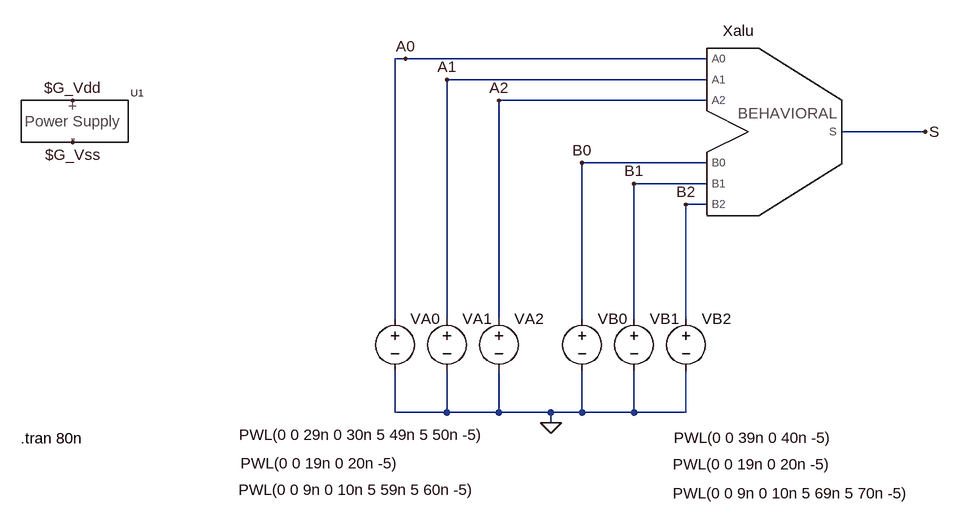
[diagram p0: schematic alu-fast_test.asc]
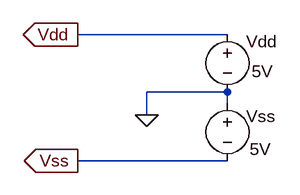
[diagram p1: sub-circuit tpower.asc]
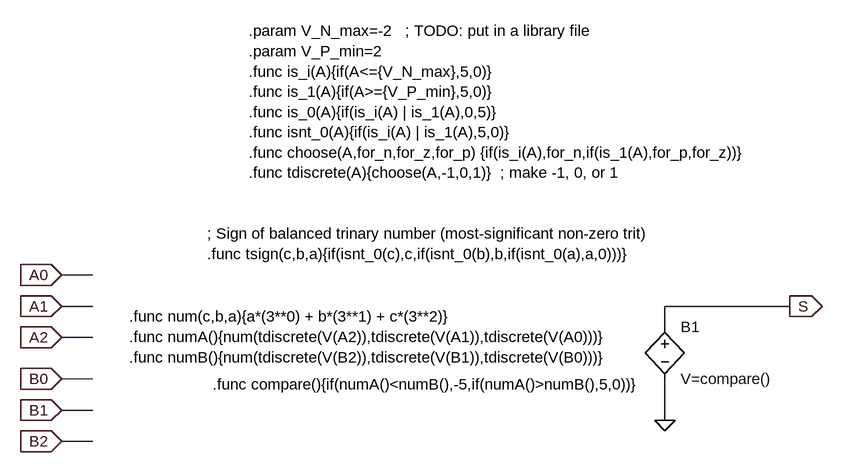
[diagram p2: sub-circuit alu-fast.asc]
alu-fast_test.asc, the LTspice schematic file:
Version 4
SHEET 1 988 700
WIRE -112 16 -128 16
WIRE 352 16 -112 16
WIRE 352 48 -48 48
WIRE 352 80 32 80
WIRE 688 128 560 128
WIRE 352 176 160 176
WIRE 352 208 240 208
WIRE 352 240 320 240
WIRE -128 416 -128 16
WIRE -48 416 -48 48
WIRE 32 416 32 80
WIRE 160 416 160 176
WIRE 240 416 240 208
WIRE 320 416 320 240
WIRE -128 560 -128 496
WIRE -48 560 -48 496
WIRE -48 560 -128 560
WIRE 32 560 32 496
WIRE 32 560 -48 560
WIRE 112 560 32 560
WIRE 160 560 160 496
WIRE 160 560 112 560
WIRE 240 560 240 496
WIRE 240 560 160 560
WIRE 320 560 320 496
WIRE 320 560 240 560
WIRE 112 576 112 560
FLAG -624 80 $G_Vdd
FLAG -624 144 $G_Vss
FLAG 688 128 S
FLAG 112 576 0
FLAG -112 16 A0
FLAG -48 48 A1
FLAG 32 80 A2
FLAG 160 176 B0
FLAG 240 208 B1
FLAG 320 240 B2
SYMBOL tpower -624 112 R0
SYMATTR InstName U1
SYMBOL alu-fast 400 16 R0
SYMATTR InstName Xalu
SYMBOL voltage 320 400 R0
WINDOW 3 -20 284 Left 0
WINDOW 123 0 0 Left 0
WINDOW 39 0 0 Left 0
SYMATTR Value PWL(0 0 9n 0 10n 5 69n 5 70n -5)
SYMATTR InstName VB2
SYMBOL voltage 240 400 R0
WINDOW 3 60 240 Left 0
WINDOW 123 0 0 Left 0
WINDOW 39 0 0 Left 0
SYMATTR Value PWL(0 0 19n 0 20n -5)
SYMATTR InstName VB1
SYMBOL voltage 160 400 R0
WINDOW 3 141 199 Left 0
WINDOW 123 0 0 Left 0
WINDOW 39 0 0 Left 0
SYMATTR Value PWL(0 0 39n 0 40n -5)
SYMATTR InstName VB0
SYMBOL voltage 32 400 R0
WINDOW 3 -401 279 Left 0
WINDOW 123 0 0 Left 0
WINDOW 39 0 0 Left 0
SYMATTR Value PWL(0 0 9n 0 10n 5 59n 5 60n -5)
SYMATTR InstName VA2
SYMBOL voltage -48 400 R0
WINDOW 3 -318 238 Left 0
WINDOW 123 0 0 Left 0
WINDOW 39 0 0 Left 0
SYMATTR Value PWL(0 0 19n 0 20n -5)
SYMATTR InstName VA1
SYMBOL voltage -128 400 R0
WINDOW 3 -240 194 Left 0
WINDOW 123 0 0 Left 0
WINDOW 39 0 0 Left 0
SYMATTR Value PWL(0 0 29n 0 30n 5 49n 5 50n -5)
SYMATTR InstName VA0
TEXT -704 600 Left 0 !.tran 80n

tpower.asc, the sub-circuit schematic file:
Version 4
SHEET 1 880 680
WIRE -112 32 -320 32
WIRE -112 112 -224 112
WIRE -112 128 -112 112
WIRE -224 144 -224 112
WIRE -112 208 -320 208
FLAG -224 144 0
FLAG -320 32 Vdd
IOPIN -320 32 Out
FLAG -320 208 Vss
IOPIN -320 208 Out
SYMBOL voltage -112 16 R0
WINDOW 0 26 26 Left 0
WINDOW 3 34 68 Left 0
SYMATTR InstName Vdd
SYMATTR Value 5V
SYMBOL voltage -112 112 R0
WINDOW 0 26 34 Left 0
WINDOW 3 31 80 Left 0
SYMATTR InstName Vss
SYMATTR Value 5V

alu-fast.asc, the sub-circuit schematic file:
Version 4
SHEET 1 992 680
WIRE -416 144 -464 144
WIRE -416 192 -464 192
WIRE 656 192 464 192
WIRE 464 224 464 192
WIRE -416 240 -464 240
WIRE -416 304 -464 304
WIRE -416 352 -464 352
WIRE 464 368 464 304
WIRE -416 400 -464 400
FLAG -464 144 A0
IOPIN -464 144 In
FLAG -464 192 A1
IOPIN -464 192 In
FLAG -464 240 A2
IOPIN -464 240 In
FLAG -464 304 B0
IOPIN -464 304 In
FLAG -464 352 B1
IOPIN -464 352 In
FLAG -464 400 B2
IOPIN -464 400 In
FLAG 656 192 S
IOPIN 656 192 Out
FLAG 464 368 0
SYMBOL bv 464 208 R0
SYMATTR InstName B1
SYMATTR Value V=compare()
TEXT -176 -232 Left 0 !.param V_N_max=-2   ; TODO: put in a library file\n.param V_P_min=2\n.func is_i(A){if(A<={V_N_max},5,0)}\n.func is_1(A){if(A>={V_P_min},5,0)}\n.func is_0(A){if(is_i(A) | is_1(A),0,5)}\n.func isnt_0(A){if(is_i(A) | is_1(A),5,0)}\n.func choose(A,for_n,for_z,for_p) {if(is_i(A),for_n,if(is_1(A),for_p,for_z))}\n.func tdiscrete(A){choose(A,-1,0,1)}  ; make -1, 0, or 1
TEXT -232 312 Left 0 !.func compare(){if(numA()<numB(),-5,if(numA()>numB(),5,0))}
TEXT -240 80 Left 0 !; Sign of balanced trinary number (most-significant non-zero trit)\n.func tsign(c,b,a){if(isnt_0(c),c,if(isnt_0(b),b,if(isnt_0(a),a,0)))}
TEXT -360 208 Left 0 !.func num(c,b,a){a*(3**0) + b*(3**1) + c*(3**2)}\n.func numA(){num(tdiscrete(V(A2)),tdiscrete(V(A1)),tdiscrete(V(A0)))}\n.func numB(){num(tdiscrete(V(B2)),tdiscrete(V(B1)),tdiscrete(V(B0)))}

The netlist it stands for:
* alu-fast_test.asc
XU1 $G_Vdd $G_Vss tpower
XXalu A0 A1 A2 B0 B1 B2 S alu-fast
VB2 B2 0 PWL(0 0 9n 0 10n 5 69n 5 70n -5)
VB1 B1 0 PWL(0 0 19n 0 20n -5)
VB0 B0 0 PWL(0 0 39n 0 40n -5)
VA2 A2 0 PWL(0 0 9n 0 10n 5 59n 5 60n -5)
VA1 A1 0 PWL(0 0 19n 0 20n -5)
VA0 A0 0 PWL(0 0 29n 0 30n 5 49n 5 50n -5)

* block symbol definitions
.subckt tpower Vdd Vss
Vdd Vdd 0 5V
Vss 0 Vss 5V
.ends tpower

.subckt alu-fast A0 A1 A2 B0 B1 B2 S
B1 S 0 V=compare()
.param V_N_max=-2   ; TODO: put in a library file
.param V_P_min=2
.func is_i(A){if(A<={V_N_max},5,0)}
.func is_1(A){if(A>={V_P_min},5,0)}
.func is_0(A){if(is_i(A) | is_1(A),0,5)}
.func isnt_0(A){if(is_i(A) | is_1(A),5,0)}
.func choose(A,for_n,for_z,for_p) {if(is_i(A),for_n,if(is_1(A),for_p,for_z))}
.func tdiscrete(A){choose(A,-1,0,1)}  ; make -1, 0, or 1
.func compare(){if(numA()<numB(),-5,if(numA()>numB(),5,0))}
; Sign of balanced trinary number (most-significant non-zero trit)
.func tsign(c,b,a){if(isnt_0(c),c,if(isnt_0(b),b,if(isnt_0(a),a,0)))}
.func num(c,b,a){a*(3**0) + b*(3**1) + c*(3**2)}
.func numA(){num(tdiscrete(V(A2)),tdiscrete(V(A1)),tdiscrete(V(A0)))}
.func numB(){num(tdiscrete(V(B2)),tdiscrete(V(B1)),tdiscrete(V(B0)))}
.ends alu-fast

.tran 80n
.backanno
.end